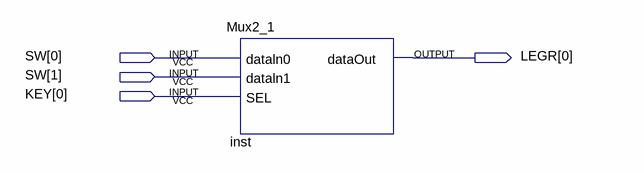
[diagram p0: schematic sheet]
// Quartus schematic Mux2_1Demo.bdf as structural Verilog: 1 symbols, 4 pins
module Mux2_1Demo (
  input  [1:0] SW,
  input  [0:0] KEY,
  output [0:0] LEGR
);

  Mux2_1 inst (.dataln0(SW[0]), .dataln1(SW[1]), .SEL(KEY[0]), .dataOut(LEGR[0]));
endmodule
